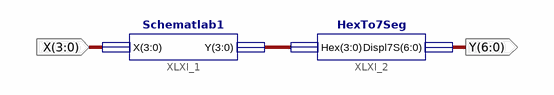
[diagram p0: schematic sheet 1]
// Xilinx ISE schematic Zadanie2.sch (xc9500xl) as structural Verilog: 2 symbols, 2 ports
module Zadanie2 (
  input  [3:0] X,
  output [6:0] Y
);

  wire [3:0] XLXN_2;

  Schematlab1 XLXI_1 (.X(X), .Y(XLXN_2));
  HexTo7Seg XLXI_2 (.Hex(XLXN_2), .Displ7S(Y));
endmodule
